# Altium schematic sheet uRFB_Connectors.SchDoc: uRFB
size 420 x 297 mm; Author: G.K.; CompanyName: WUT; DrawnBy: G.K.; Organization: CERN; Address1: Warsaw Univeristy of Technology; Address2: Nowowiejska 15/19; DocumentNumber: 8; Revision: -; SheetNumber: 8; SheetTotal: -; EDA_Number: ARTIQ; Projet: RTM 4SFP 3QSFP; ModifiedBy: -; CreateDate: XX/XX/XXXX; CheckedDate: -; Title2: connector; DivGrp: ISE; Designer: G.K.; ModifiedDate: -; ProjectName: RTM 4SFP 3QSFP
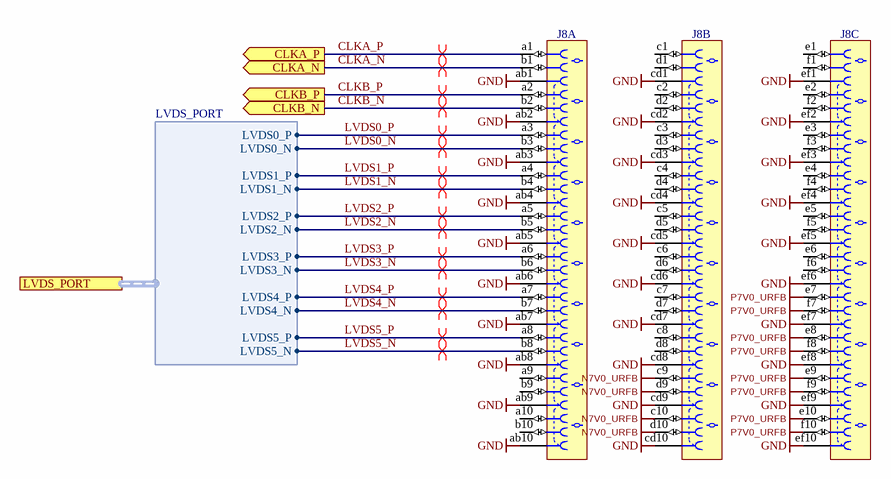
[diagram p0: uRFB_Connectors.SchDoc]

## Parts
J8  Hard Metric Type ZD  [ERNI_973028]  (value not drawn)  (parts A,B,C of 3)

## Ports
CLKA_N (out), CLKA_P (out), CLKB_N (out), CLKB_P (out), LVDS_PORT (harness LVDS_PORT)

## Harnesses
LVDS_PORT: LVDS0_P, LVDS0_N, LVDS1_P, LVDS1_N, LVDS2_P, LVDS2_N, LVDS3_P, LVDS3_N, LVDS4_P, LVDS4_N, LVDS5_P, LVDS5_N

## Nets
GND: J8.ab1 J8.ab2 J8.ab3 J8.ab4 J8.ab5 J8.ab6 J8.ab7 J8.ab8 J8.ab9 J8.ab10 J8.cd1 J8.cd2 J8.cd3 J8.cd4 J8.cd5 J8.cd6 J8.cd7 J8.cd8 J8.cd9 J8.cd10 J8.ef1 J8.ef2 J8.ef3 J8.ef4 J8.ef5 J8.ef6 J8.ef7 J8.ef8 J8.ef9 J8.ef10
N7V0_URFB: J8.c9 J8.c10 J8.d9 J8.d10
P7V0_URFB: J8.e7 J8.e8 J8.e9 J8.e10 J8.f7 J8.f8 J8.f9 J8.f10
CLKA_N: J8.b1 ; port CLKA_N
CLKA_P: J8.a1 ; port CLKA_P
CLKB_N: J8.b2 ; port CLKB_N
CLKB_P: J8.a2 ; port CLKB_P
LVDS0_N: J8.b3 ; port LVDS_PORT.LVDS0_N
LVDS0_P: J8.a3 ; port LVDS_PORT.LVDS0_P
LVDS1_N: J8.b4 ; port LVDS_PORT.LVDS1_N
LVDS1_P: J8.a4 ; port LVDS_PORT.LVDS1_P
LVDS2_N: J8.b5 ; port LVDS_PORT.LVDS2_N
LVDS2_P: J8.a5 ; port LVDS_PORT.LVDS2_P
LVDS3_N: J8.b6 ; port LVDS_PORT.LVDS3_N
LVDS3_P: J8.a6 ; port LVDS_PORT.LVDS3_P
LVDS4_N: J8.b7 ; port LVDS_PORT.LVDS4_N
LVDS4_P: J8.a7 ; port LVDS_PORT.LVDS4_P
LVDS5_N: J8.b8 ; port LVDS_PORT.LVDS5_N
LVDS5_P: J8.a8 ; port LVDS_PORT.LVDS5_P

Not connected (* = marked no-connect by the designer): J8 a9 a10 b9 b10 c1 c2 c3 c4 c5 c6 c7 c8 d1 d2 d3 d4 d5 d6 d7 d8 e1 e2 e3 e4 e5 e6 f1 f2 f3 f4 f5 f6

## Layout directives
differential pair; net class Diff_100Ohm: CLKA_N, CLKA_P, CLKB_N, CLKB_P, LVDS0_N, LVDS0_P, LVDS1_N, LVDS1_P, LVDS2_N, LVDS2_P, LVDS3_N, LVDS3_P, LVDS4_N, LVDS4_P, LVDS5_N, LVDS5_P

## Notes on the sheet
- Project/Equipment
- Document
- Designer
- Drawn by
- Check.by
- Copyright WUT ISE 2018.
  This documentation describes Open Hardware and is licensed under the CERN OHL v.1.1. You may redistribute and modify this documentation under the terms of the CERN OHL v.1.1. (http://ohwr.org/CERNOHL). This documentation is distributed WITHOUT ANY EXPRESS OR IMPLIED WARRANTY, INCLUDING OF MERCHANTABILITY, SATISFACTORY QUALITY AND FITNESS FOR A PARTICULAR PURPOSE. Please see the CERN OHL v.1.1 for applicable conditions.
- Contact
- File
- Last Mod.
- Print Date
- Sheet
- Size
- A3
- of
- Rev

## Library data of the parts
J8 = ERNI_973028: 90 Contacts, 6 Rows  (a,b,c,d,e,f) of 10 positions + 3 Shield Rows (ab, cd, ef) of 10 Positions, Pitch 2.5 mm,  Press-Fit, Right Angle ERmet ZD High Speed Differential Hard Metric Female Connector; Part Description: 90 Contacts (10x3 Pairs Signal Contacts + 3x10 Ground Contacts), Pitch 2.5mm, Press-Fit, Right Angle Ermet ZD High Speed Differential Hard Metric Female Connector; Manufacturer: ERNI; Manufacturer Part Number: 973028; Part Number: ERNI_973028; Component Kind: Standard; Component Type: Standard; Pin Count: 90; Family: Hard Metric Type ZD; Mounted: Yes; Socket: No; SMD: No; PressFit: Yes; Sense: No; Status: None; ComponentHeight: 16.9mm; HelpURL: \\cern.ch\dfs\Applications\Altium\Datasheets\ERNI_973028.pdf; Author: CERN DEM JLC; CreateDate: 18.04.2012; LatestRevisionDate: 18.04.2012